# Altium schematic sheet Motor_Driver2.SchDoc
size A4; SheetNumber: 5; SheetTotal: 8
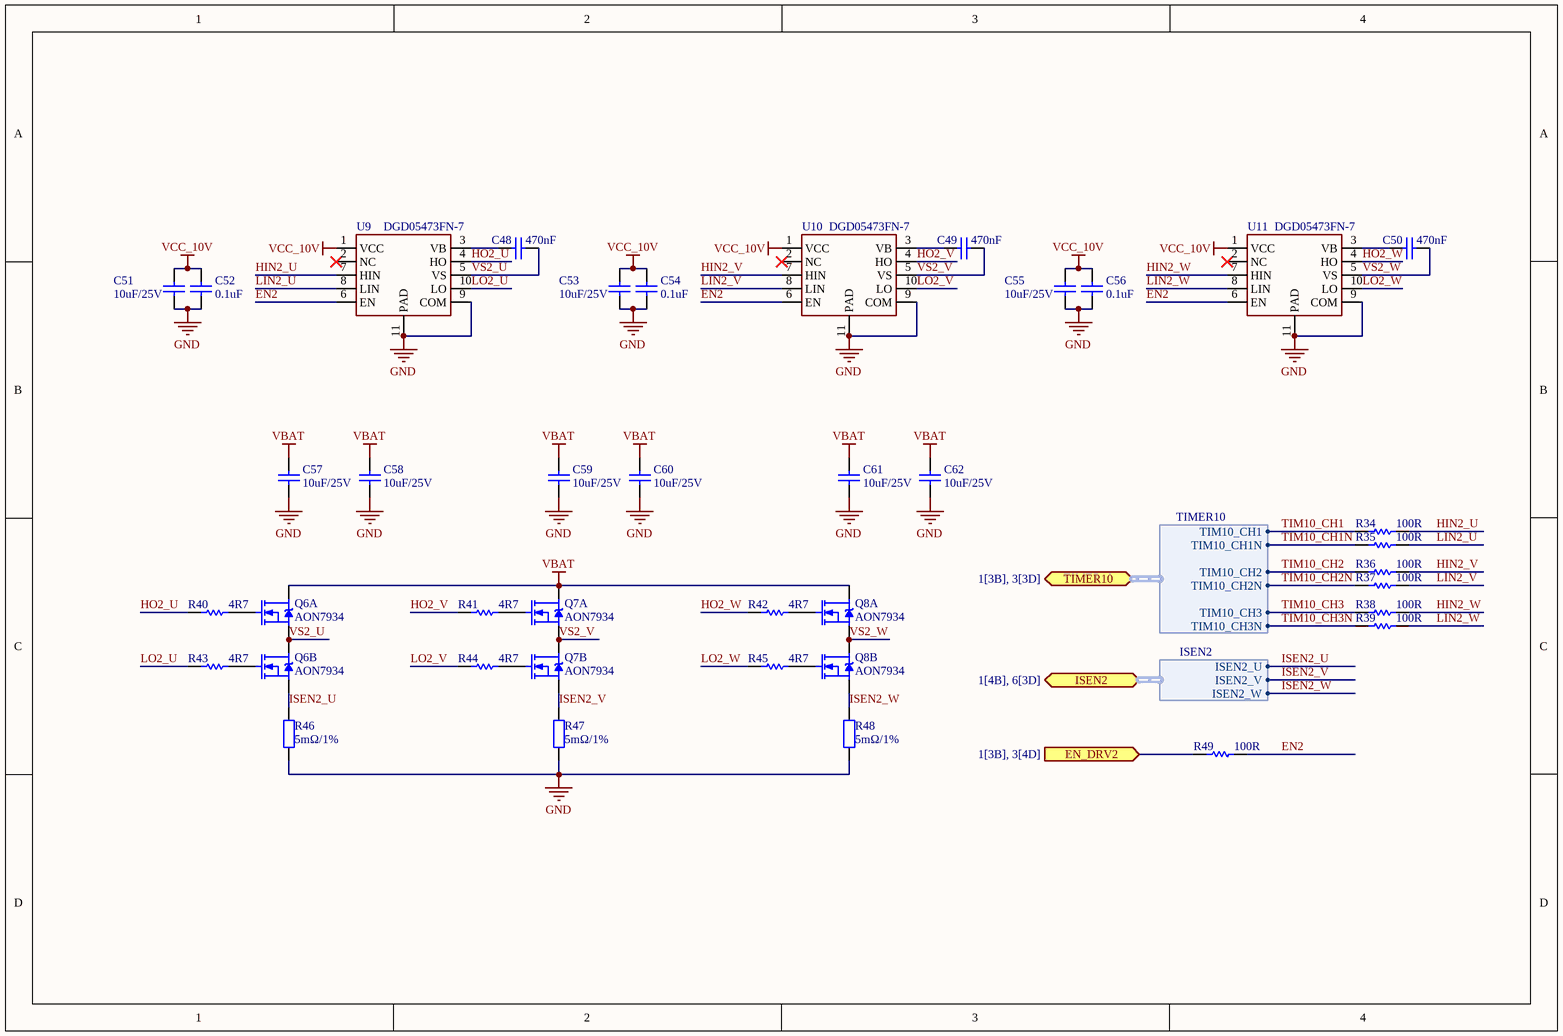
[diagram p0: Motor_Driver2.SchDoc]

## Parts
C48  470nF  [C0603_NS]
C49  470nF  [C0603_NS]
C50  470nF  [C0603_NS]
C51  10uF/25V  [C0603_NS]
C52  0.1uF  [C0603_NS]
C53  10uF/25V  [C0603_NS]
C54  0.1uF  [C0603_NS]
C55  10uF/25V  [C0603_NS]
C56  0.1uF  [C0603_NS]
C57  10uF/25V  [C0603_NS]
C58  10uF/25V  [C0603_NS]
C59  10uF/25V  [C0603_NS]
C60  10uF/25V  [C0603_NS]
C61  10uF/25V  [C0603_NS]
C62  10uF/25V  [C0603_NS]
Q6  AON7934  [POWERPAIR_3X3]  (parts A,B of 2)
Q7  AON7934  [POWERPAIR_3X3]  (parts A,B of 2)
Q8  AON7934  [POWERPAIR_3X3]  (parts A,B of 2)
R34  100R  [R0603_NS]
R35  100R  [R0603_NS]
R36  100R  [R0603_NS]
R37  100R  [R0603_NS]
R38  100R  [R0603_NS]
R39  100R  [R0603_NS]
R40  4R7  [R0603_NS]
R41  4R7  [R0603_NS]
R42  4R7  [R0603_NS]
R43  4R7  [R0603_NS]
R44  4R7  [R0603_NS]
R45  4R7  [R0603_NS]
R46  5mΩ/1%  [R1206_NS]
R47  5mΩ/1%  [R1206_NS]
R48  5mΩ/1%  [R1206_NS]
R49  100R  [R0603_NS]
U9  DGD05473FN-7  [W-DFN3030-10_DGD05473]
U10  DGD05473FN-7  [W-DFN3030-10_DGD05473]
U11  DGD05473FN-7  [W-DFN3030-10_DGD05473]

## Ports
EN_DRV2 (in, see 1[3B], 3[4D]), ISEN2 (bidir, harness ISEN2, see 1[4B], 6[3D]), TIMER10 (bidir, harness TIMER10, see 1[3B], 3[3D])

## Harnesses
TIMER10: TIM10_CH1N, TIM10_CH2N, TIM10_CH3N, TIM10_CH1, TIM10_CH2, TIM10_CH3
ISEN2: ISEN2_U, ISEN2_V, ISEN2_W

## Nets
GND: C51.2 C52.2 C53.2 C54.2 C55.2 C56.2 C57.1 C58.1 C59.1 C60.1 C61.1 C62.1 R46.1 R47.1 R48.1 U9.9(COM) U9.11(PAD) U10.9(COM) U10.11(PAD) U11.9(COM) U11.11(PAD)
VBAT: C57.2 C58.2 C59.2 C60.2 C61.2 C62.2 Q6.D1 Q7.D1 Q8.D1
VCC_10V: C51.1 C52.1 C53.1 C54.1 C55.1 C56.1 U9.1(VCC) U10.1(VCC) U11.1(VCC)
EN2: R49.2 U9.6(EN) U10.6(EN) U11.6(EN)
EN_DRV2: R49.1 ; port EN_DRV2
HIN2_U: R34.2 U9.7(HIN)
HIN2_V: R36.2 U10.7(HIN)
HIN2_W: R38.2 U11.7(HIN)
HO2_U: R40.1 U9.4(HO)
HO2_V: R41.1 U10.4(HO)
HO2_W: R42.1 U11.4(HO)
ISEN2_U: Q6.S2 R46.2 ; port ISEN2.ISEN2_U
ISEN2_V: Q7.S2 R47.2 ; port ISEN2.ISEN2_V
ISEN2_W: Q8.S2 R48.2 ; port ISEN2.ISEN2_W
LIN2_U: R35.2 U9.8(LIN)
LIN2_V: R37.2 U10.8(LIN)
LIN2_W: R39.2 U11.8(LIN)
LO2_U: R43.1 U9.10(LO)
LO2_V: R44.1 U10.10(LO)
LO2_W: R45.1 U11.10(LO)
TIM10_CH1: R34.1 ; port TIMER10.TIM10_CH1
TIM10_CH1N: R35.1 ; port TIMER10.TIM10_CH1N
TIM10_CH2: R36.1 ; port TIMER10.TIM10_CH2
TIM10_CH2N: R37.1 ; port TIMER10.TIM10_CH2N
TIM10_CH3: R38.1 ; port TIMER10.TIM10_CH3
TIM10_CH3N: R39.1 ; port TIMER10.TIM10_CH3N
VS2_U: C48.2 Q6.S1/D2 U9.5(VS)
VS2_V: C49.2 Q7.S1/D2 U10.5(VS)
VS2_W: C50.2 Q8.S1/D2 U11.5(VS)
NetC48_1: C48.1 U9.3(VB)
NetC49_1: C49.1 U10.3(VB)
NetC50_1: C50.1 U11.3(VB)
NetQ6_G1: Q6.G1 R40.2
NetQ6_G2: Q6.G2 R43.2
NetQ7_G1: Q7.G1 R41.2
NetQ7_G2: Q7.G2 R44.2
NetQ8_G1: Q8.G1 R42.2
NetQ8_G2: Q8.G2 R45.2

Not connected (* = marked no-connect by the designer): U9 2(NC)*; U10 2(NC)*; U11 2(NC)*

## Library data of the parts
C48-C56 = Cap: Capacitor; Value: 1uF; Published: 8-Jun-2000; LatestRevisionDate: 17-Jul-2002; LatestRevisionNote: Re-released for DXP Platform.; PackageReference: RAD-0.3; Publisher: Altium Limited; PackageDescription: Radial Cap, Thru-Hole; 2 Leads; 0.3 in Pin Spacing
C57-C62 = Cap: Capacitor
R34-R45 R49 = Res1: Resistor
R46-R48 = Res2: Resistor; Value: 15mΩ; Published: 8-Jun-2000; LatestRevisionDate: 17-Jul-2002; LatestRevisionNote: Re-released for DXP Platform.; PackageReference: AXIAL-0.4; Publisher: Altium Limited; PackageDescription: Axial Device, Thru-Hole; 2 Leads; 0.4 in Pin Spacing
U9-U11 = DGD05473